# EAGLE design akabeacon_square_type1_MDBT40 (EAGLE 7.4.0)
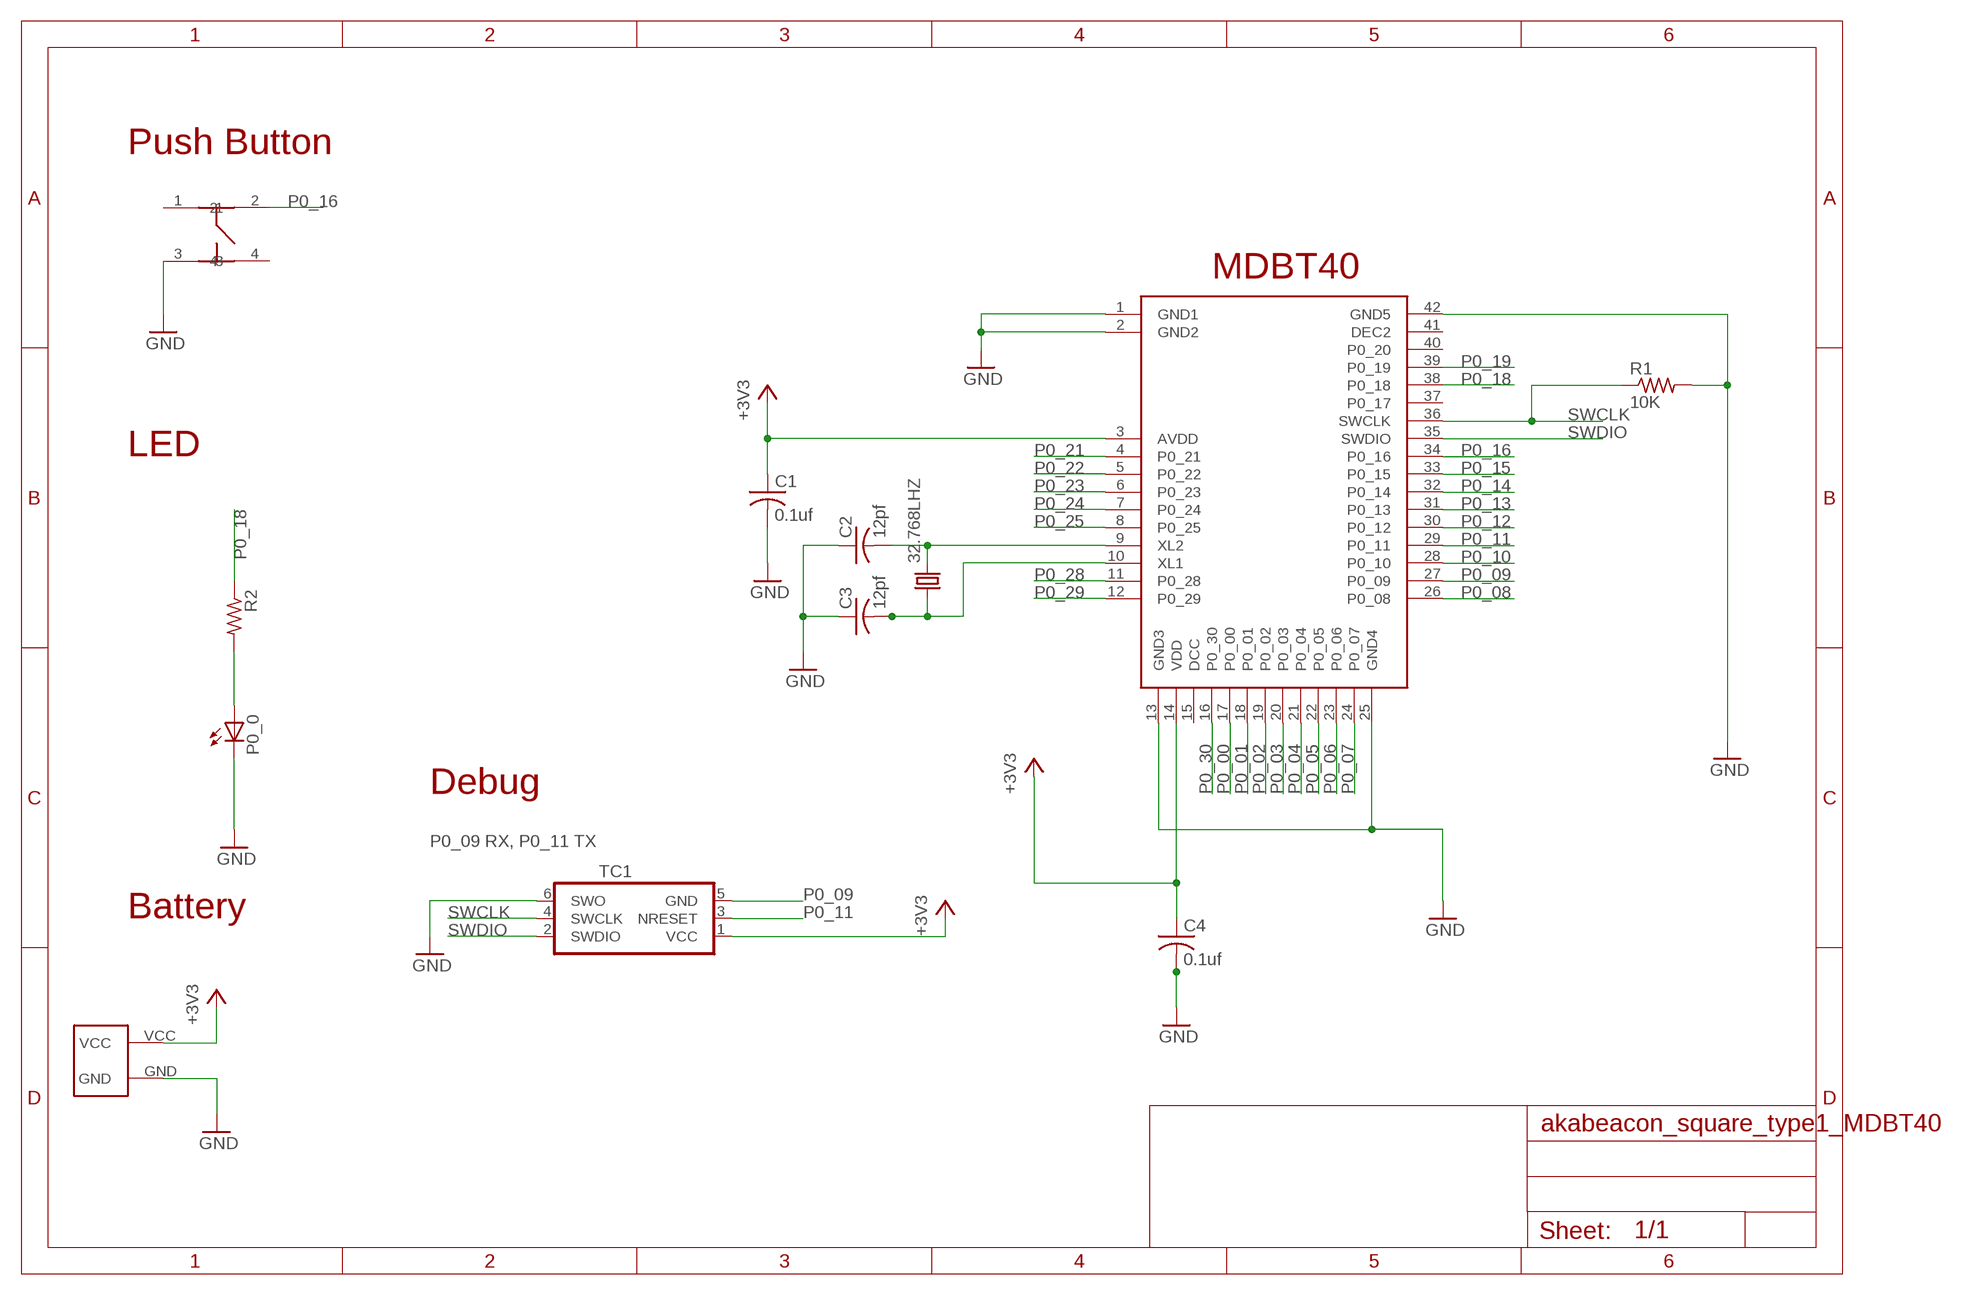
[diagram p0: schematic, sheet 1]

## Parts
32.768LHZ  FC-12M  [FC-12M]
C1  0.1uf  C-USC0603  [C0603]
C2  12pf  C-USC0603  [C0603]
C3  12pf  C-USC0603  [C0603]
C4  0.1uf  C-USC0603  [C0603]
P0_0  LEDCHIP-LED0603  [CHIP-LED0603]
R1  10K  R-US_R0603  [R0603]
R2  R-US_R0603  [R0603]
TC1  TC2030-IDC-NL  [TC2030-IDC-NL]
U$2  SQUARE-TYPE1  [SQUARE-TYPE1-TC2030]
U$3  RAYTAC-MDBT40  [RAYTAC-MDBT40]
U$6  SWICTH-4P(KMR2)  [SWITCH-4P(KMR2)]

## Nets
+3V3: C1.1 C4.1 TC1.1(VCC) U$2.VCC U$3.3(AVDD) U$3.14(VDD)
GND: C1.2 C2.1 C3.1 C4.2 P0_0.C R1.2 TC1.6(SWO) U$2.GND U$3.1(GND1) U$3.2(GND2) U$3.13(GND3) U$3.25(GND4) U$3.42(GND5) U$6.3
N$1: P0_0.A R2.2
N$7: 32.768LHZ.2 C2.2 U$3.9(XL2)
N$8: 32.768LHZ.1 C3.2 U$3.10(XL1)
P0_00: U$3.17(P0_00)
P0_01: U$3.18(P0_01)
P0_02: U$3.19(P0_02)
P0_03: U$3.20(P0_03)
P0_04: U$3.21(P0_04)
P0_05: U$3.22(P0_05)
P0_06: U$3.23(P0_06)
P0_07: U$3.24(P0_07)
P0_08: U$3.26(P0_08)
P0_09: TC1.5(GND) U$3.27(P0_09)
P0_10: U$3.28(P0_10)
P0_11: TC1.3(NRESET) U$3.29(P0_11)
P0_12: U$3.30(P0_12)
P0_13: U$3.31(P0_13)
P0_14: U$3.32(P0_14)
P0_15: U$3.33(P0_15)
P0_16: U$3.34(P0_16) U$6.2
P0_18: R2.1 U$3.38(P0_18)
P0_19: U$3.39(P0_19)
P0_21: U$3.4(P0_21)
P0_22: U$3.5(P0_22)
P0_23: U$3.6(P0_23)
P0_24: U$3.7(P0_24)
P0_25: U$3.8(P0_25)
P0_28: U$3.11(P0_28)
P0_29: U$3.12(P0_29)
P0_30: U$3.16(P0_30)
SWCLK: R1.1 TC1.4(SWCLK) U$3.36(SWCLK)
SWDIO: TC1.2(SWDIO) U$3.35(SWDIO)
Unconnected: U$3.15(DCC) U$3.37(P0_17) U$3.40(P0_20) U$3.41(DEC2) U$6.1 U$6.4

## Notes on the sheet
- Push Button
- MDBT40
- LED
- Debug
- P0_09 RX, P0_11 TX
- Battery

## Library data of the parts
32.768LHZ = crystal:FC-12M: kHz RANGE CRYSTAL UNIT LOW PROFILE SMD Source: Epson Toyocom FC-12M.pdf
C1-C4 = adafruit:C-US: CAPACITOR, American symbol
P0_0 = led:LED: LED OSRAM: - CHIPLED LG R971, LG N971, LY N971, LG Q971, LY Q971, LO R971, LY R971 LH N974, LH R974 LS Q976, LO Q976, LY Q976 LO Q996 - Hyper CHIPLED LW Q18S LB Q993, LB Q99A, LB R99A - SideLED LS A670, LO A670, LY A670, LG A670, LP A670 LB A673, LV A673, LT A673, LW A673 LH A674 LY A675 LS A676, LA A676, LO A676, LY A676, LW A676 LS A679, LY A679, LG A679 - Hyper Micro SIDELED® LS Y876, LA Y876, LO Y876, LY Y876 LT Y87S - SmartLED LW L88C, LW L88S LB L89C, LB L89S, LG L890 LS L89K, LO L89K, LY L89K LS L896, LA L896, LO L896, LY L896 - TOPLED LS T670, LO T670, LY T670, LG T670, LP T670 LSG T670, LSP T670, LSY T670, LOP T670, LYG T670 LG T671, LOG T671, LSG T671 LB T673, LV T673, LT T673, LW T673 LH T674 LS T676, LA T676, LO T676, LY T676, LB T676, LH T676, LSB T676, LW T676 LB T67C, LV T67C, LT T67C, LS T67K, LO T67K, LY T67K, LW E67C LS E67B, LA E67B, LO E67B, LY E67B, LB E67C, LV E67C, LT E67C LW T67C LS T679, LY T679, LG T679 LS T770, LO T770, LY T770, LG T770, LP T770 LB T773, LV T773, LT T773, LW T773 LH T774 LS E675, LA E675, LY E675, LS T675 LS T776, LA T776, LO T776, LY T776, LB T776 LHGB T686 LT T68C, LB T68C - Hyper Mini TOPLED® LB M676 - Mini TOPLED Santana® LG M470 LS M47K, LO M47K, LY M47K Source: http://www.osram.convergy.de LUXEON: - LUMILED® LXK2-PW12-R00, LXK2-PW12-S00, LXK2-PW14-U00, LXK2-PW14-V00 LXK2-PM12-R00, LXK2-PM12-S00, LXK2-PM14-U00 LXK2-PE12-Q00, LXK2-PE12-R00, LXK2-PE12-S00, LXK2-PE14-T00, LXK2-PE14-U00 LXK2-PB12-K00, LXK2-PB12-L00, LXK2-PB12-M00, LXK2-PB14-N00, LXK2-PB14-P00, LXK2-PB14-Q00 LXK2-PR12-L00, LXK2-PR12-M00, LXK2-PR14-Q00, LXK2-PR14-R00 LXK2-PD12-Q00, LXK2-PD12-R00, LXK2-PD12-S00 LXK2-PH12-R00, LXK2-PH12-S00 LXK2-PL12-P00, LXK2-PL12-Q00, LXK2-PL12-R00 Source: www.luxeon.com KINGBRIGHT: KA-3528ASYC Source: www.kingbright.com
R1 R2 = adafruit:R-US_: RESISTOR, American symbol
TC1 = TagConnect:TC2030-IDC: Tag-Connect In Circuit Programming & Debug Cable 6 Pin http://www.tag-connect.com
U$2 = GClue-Beacon:SQUARE-TYPE1
U$3 = gclueBT:RAYTAC-MDBT40
U$6 = gclue-test:SWICTH-4P(KMR2)

## Board
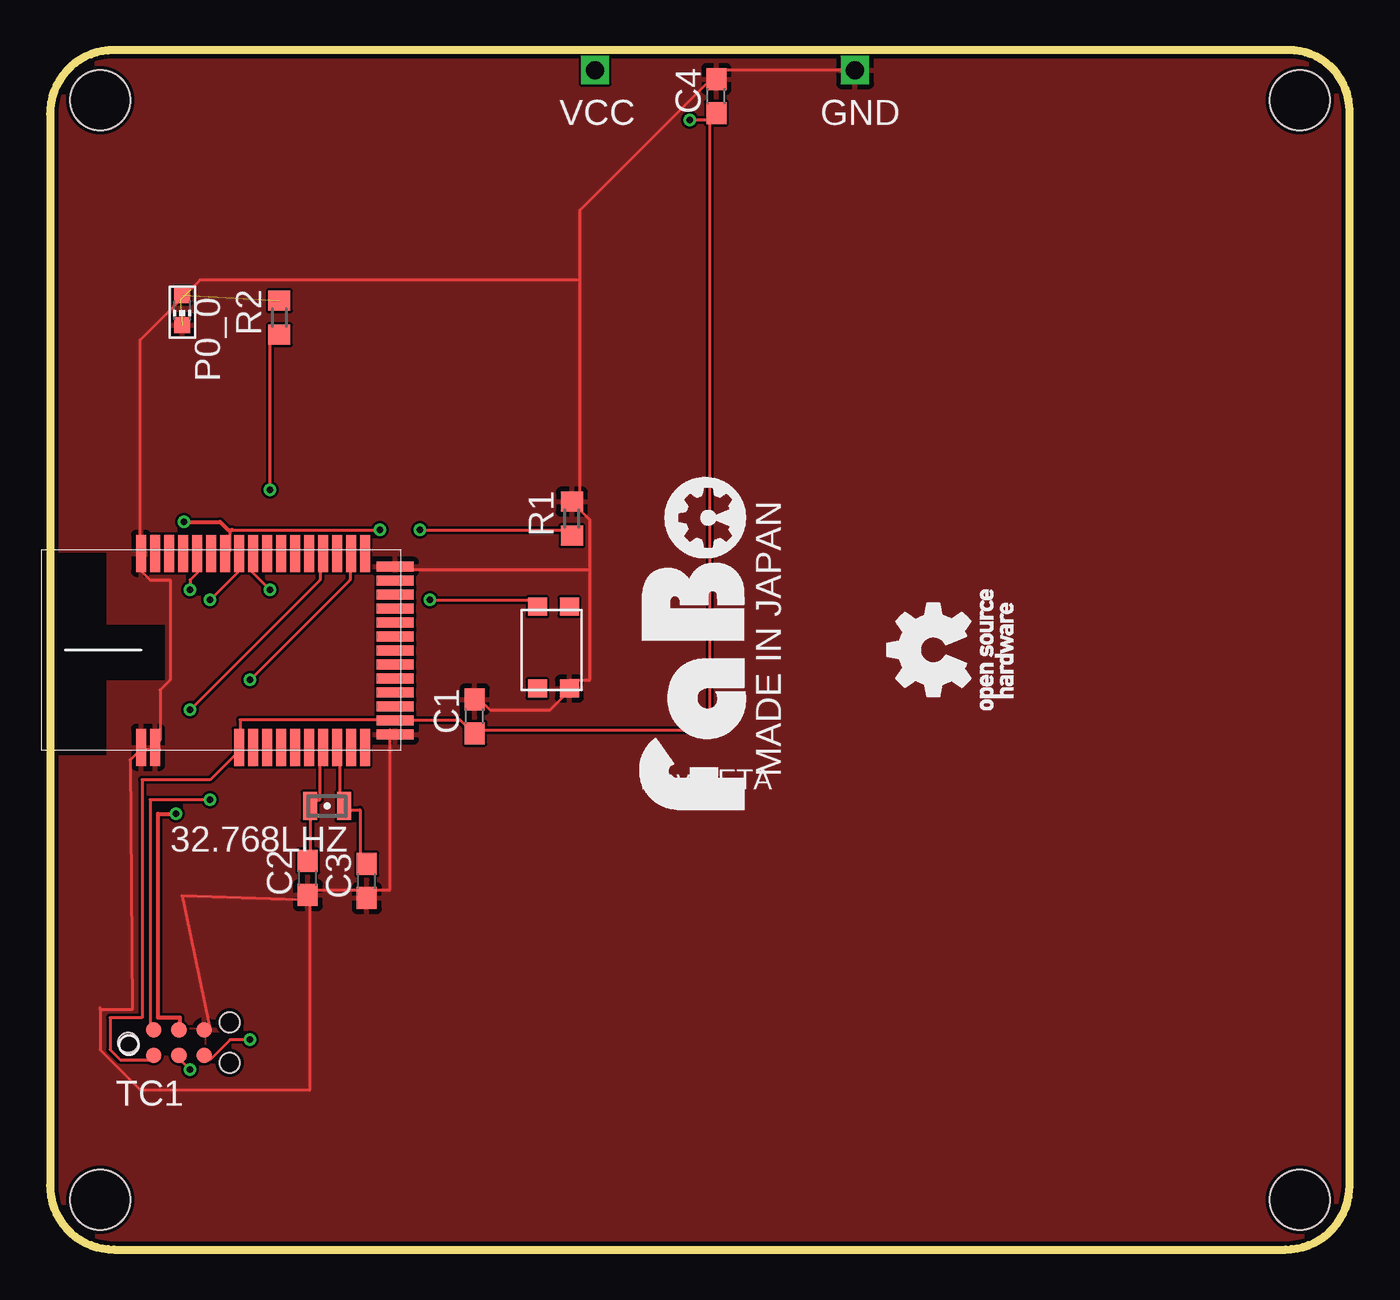
[diagram p1: board, top side]
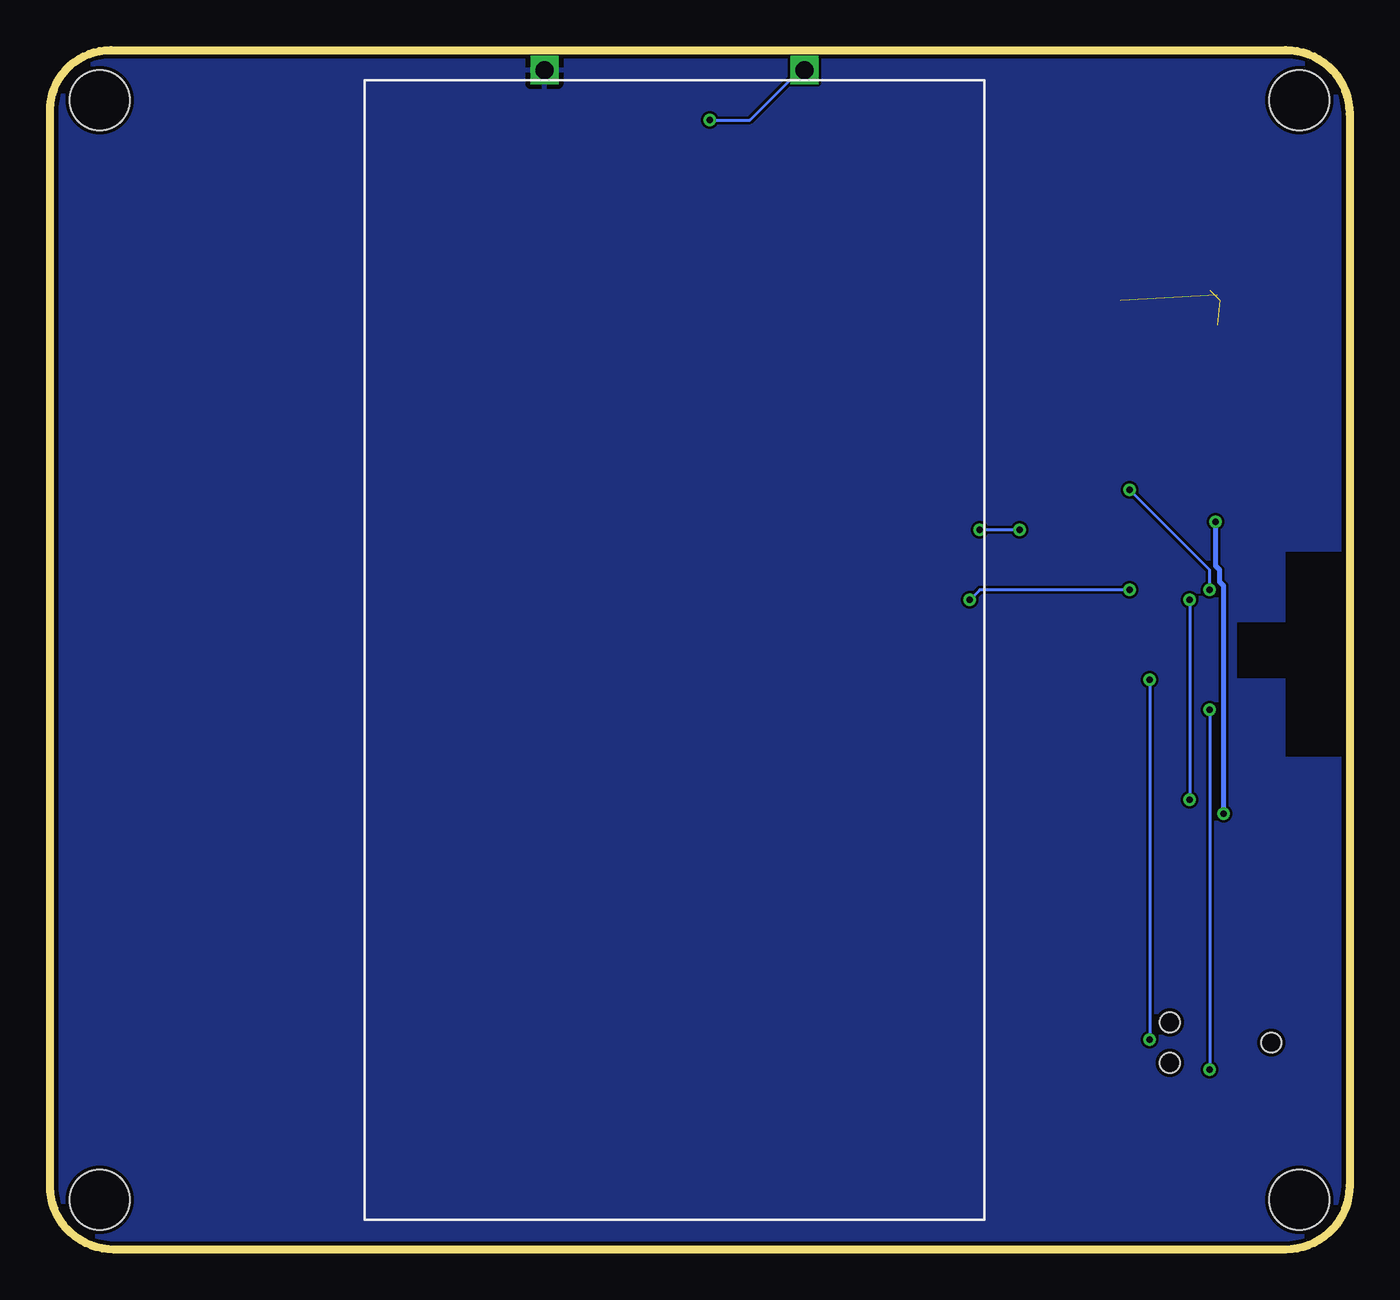
[diagram p2: board, bottom side, seen from below]

Size 65 x 60 mm. Coordinates in mm from the lower left corner, seen from the top.
Copper layers (1*16): Top 0.035mm / dielectric 1.5mm / Bottom 0.035mm
Design rules "SeeedStudio_2layer_DRU_no_angle_20140221 *": minimum track width 6mil, minimum drill 12mil, track to track 5mil, track to pad 5mil, pad to pad 5mil, via to via 5mil, smd to smd 0mil, copper to edge 8mil, drill to drill 8mil, minimum pad ring 10mil, minimum via ring 6mil, stop-mask expansion 2mil, vias tented up to drill 100mil, thermal gap 10mil
tRestrict: area -1.8,24.7 to 2.8,34.8; area 2.9,28.5 to 5.7,31.2
bRestrict: area -1.8,24.7 to 3.2,34.9; area 2.8,28.6 to 5.6,31.4

### Footprints (pad centres in the part's own frame; a part is rotated, then mirrored left to right if it is on the bottom)
FC-12M = smd 0.7 x 1.4: 1 -0.85,0; 2 0.85,0
C0603 = smd 1.1 x 1: 1 -0.85,0; 2 0.85,0
CHIP-LED0603 = smd 0.8 x 0.8: A 0,-0.75; C 0,0.75
R0603 = smd 1 x 1.1: 1 -0.85,0; 2 0.85,0
TC2030-IDC-NL = smd 0.787 x 0.787: 1 -1.27,-0.635; 2 -1.27,0.635; 3 0,-0.635; 4 0,0.635; 5 1.27,-0.635; 6 1.27,0.635 | hole 0.991: -2.54,0; 2.54,1.016; 2.54,-1.016
SQUARE-TYPE1-TC2030 = drill 0.9 square: GND 7.77,29; VCC -5.23,29 | hole 3: 30.02,27.48; 30.02,-27.52; -29.98,-27.52; -29.98,27.48
RAYTAC-MDBT40 = smd 1.85 x 0.5: 1 -4.86,4; 2 -4.86,3.3; 3 -4.86,-0.9; 4 -4.86,-1.6; 5 -4.86,-2.3; 6 -4.86,-3; 7 -4.86,-3.7; 8 -4.86,-4.4; 9 -4.86,-5.1; 10 -4.86,-5.8; 11 -4.86,-6.5; 12 -4.86,-7.2; 26 4.84,-7.2; 27 4.84,-6.5; 28 4.84,-5.8; 29 4.84,-5.1; 30 4.84,-4.4; 31 4.84,-3.7; 32 4.84,-3; 33 4.84,-2.3; 34 4.84,-1.6; 35 4.84,-0.9; 36 4.84,-0.2; 37 4.84,0.5; 38 4.84,1.2; 39 4.84,1.9; 40 4.84,2.6; 41 4.84,3.3; 42 4.84,4 | smd 0.5 x 1.85: 13 -4.22,-8.71; 14 -3.52,-8.71; 15 -2.82,-8.71; 16 -2.12,-8.71; 17 -1.42,-8.71; 18 -0.72,-8.71; 19 -0.02,-8.71; 20 0.68,-8.71; 21 1.38,-8.71; 22 2.08,-8.71; 23 2.78,-8.71; 24 3.48,-8.71; 25 4.18,-8.71
SWITCH-4P(KMR2) = smd 0.9 x 0.95: 1 -1,0; 2 3.1,0; 3 -1,-1.6; 4 3.1,-1.6

### Placement (x,y rotation side)
32.768LHZ  13.86,22.18 180 top
C1  21.24,26.67 90 top
C2  12.89,18.58 90 top
C3  15.84,18.43 90 top
C4  33.33,57.69 90 top
P0_0  6.62,46.98 180 top
R1  26.1,36.56 90 top
R2  11.47,46.61 90 top
TC1  6.45,10.35 0 top
U$2  32.5,30 0 top
U$3  8.56,29.98 90 top
U$6  24.38,29.06 90 top

### Tracks (layer width: path | path; a pad name or v marks a point on that pad's centre or on a via)
+3V3  (via drill 0.3)
  Top 0.152: TC1.1 5,9.5 3.5,9.5 3,10 3,11.6 4.6,11.6 4.6,23.5 8,23.5 9.5,25 U$3.3 9.5,25.5 9.5,26.5 17,26.5 U$3.14 17.5,26.5 20.5,26.5 21,26 C1.1 21.5,26 33,26 33,56.5 | 33,56.5 v32,56.5 | 33,56.5 C4.1
  Bottom 0.152: v32,56.5 30,56.5 27.5,59 U$2.VCC
GND  (2 unrouted)
  Top 0.152: TC1.6 8,11 6.6,17.7 12.5,17.5 C2.1 | C2.1 13,18 15.5,18 C3.1 16,18 17,18 17,26 U$3.13 | 4.5,25 5.5,25 U$3.2 5.5,25.5 5.5,28 6,28.5 6,33.5 5,33.5 4.5,34 4.5,34.5 U$3.42 4.5,35 4.5,45.5 6.5,47.5 | 2.5,12 2.5,10 4.5,8 13,8 13,17.5 C2.1 | 2.5,12 4.1,12 4,24.5 4.5,25 | 2.5,12 2.5,12.1 | 4.5,25 U$3.1 | U$2.GND 33.5,59 C4.2 33,58.5 26.5,52 26.5,48.5 | C1.2 21.5,27.5 22,27 25,27 26,28 U$6.3 26,28.5 27,28.5 27,34 | 27,34 27,36.5 26.5,37 R1.2 26.5,37.5 26.5,48.5 | 27,34 17.5,34 U$3.25 | 7,48 7.5,48.5 26.5,48.5
  pour Top: -0.5,0 65.5,0 65.5,60 -0.5,60
  pour Bottom: -0.5,0 65.5,0 65.5,60 -0.5,60
N$1  (1 unrouted)
N$7
  Top 0.152: C2.2 13,19.5 13,22 32.768LHZ.2 13,22.5 13.5,22.5 13.5,25 U$3.9
N$8
  Top 0.152: C3.2 15.5,19.5 15.5,22 15,22 32.768LHZ.1 14.5,22.5 14.5,25 U$3.10
P0_09  (via drill 0.3)
  Top 0.152: v10,10.5 9,10.5 8,9.5 TC1.5 | v10,28.5 15,33.5 15,34.5 U$3.27
  Bottom 0.152: v10,28.5 v10,10.5
P0_11  (via drill 0.3)
  Top 0.152: v7,9 6.5,9.5 TC1.3 | v7,27 13.5,33.5 13.5,34.5 U$3.29
  Bottom 0.152: v7,27 v7,9
P0_16  (via drill 0.3)
  Top 0.152: v19,32.5 24,32.5 U$6.2 | v11,33 10,34 10,34.5 U$3.34
  Bottom 0.152: v19,32.5 18.5,33 v11,33
P0_18  (via drill 0.3)
  Top 0.152: v11,38 11,45.5 R2.1 | v7,33 7,33.5 7.5,34 7.5,34.5 U$3.38
  Bottom 0.152: v11,38 7,34 v7,33
SWCLK  (via drill 0.3)
  Top 0.152: v18.5,36 26,36 R1.1 | v16.5,36 9.1,36 9,36 9,35 U$3.36
  Top 0.2: 6.5,10.98 6.5,11.6 5.4,11.6 5.4,21.8 v6.3,21.8 | 9.1,36 8.9,36 8.5,36.4 v6.7,36.4
  Top 0.254: TC1.4 6.5,10.98
  Bottom 0.152: v16.5,36 v18.5,36
  Bottom 0.254: v6.7,36.4 6.7,34.2 6.5,34 6.5,33.4 6.3,33.2 v6.3,21.8
SWDIO  (via drill 0.3)
  Top 0.152: v8,22.5 5,22.5 5,11 TC1.2 | v8,32.5 9.5,34 9.5,34.5 U$3.35
  Bottom 0.152: v8,32.5 v8,22.5

### Text on the board
tPlace: Rev.BETA